# Altium schematic sheet Shutdown Circuit.SchDoc
size 279 x 187 mm; Origin: Eagle
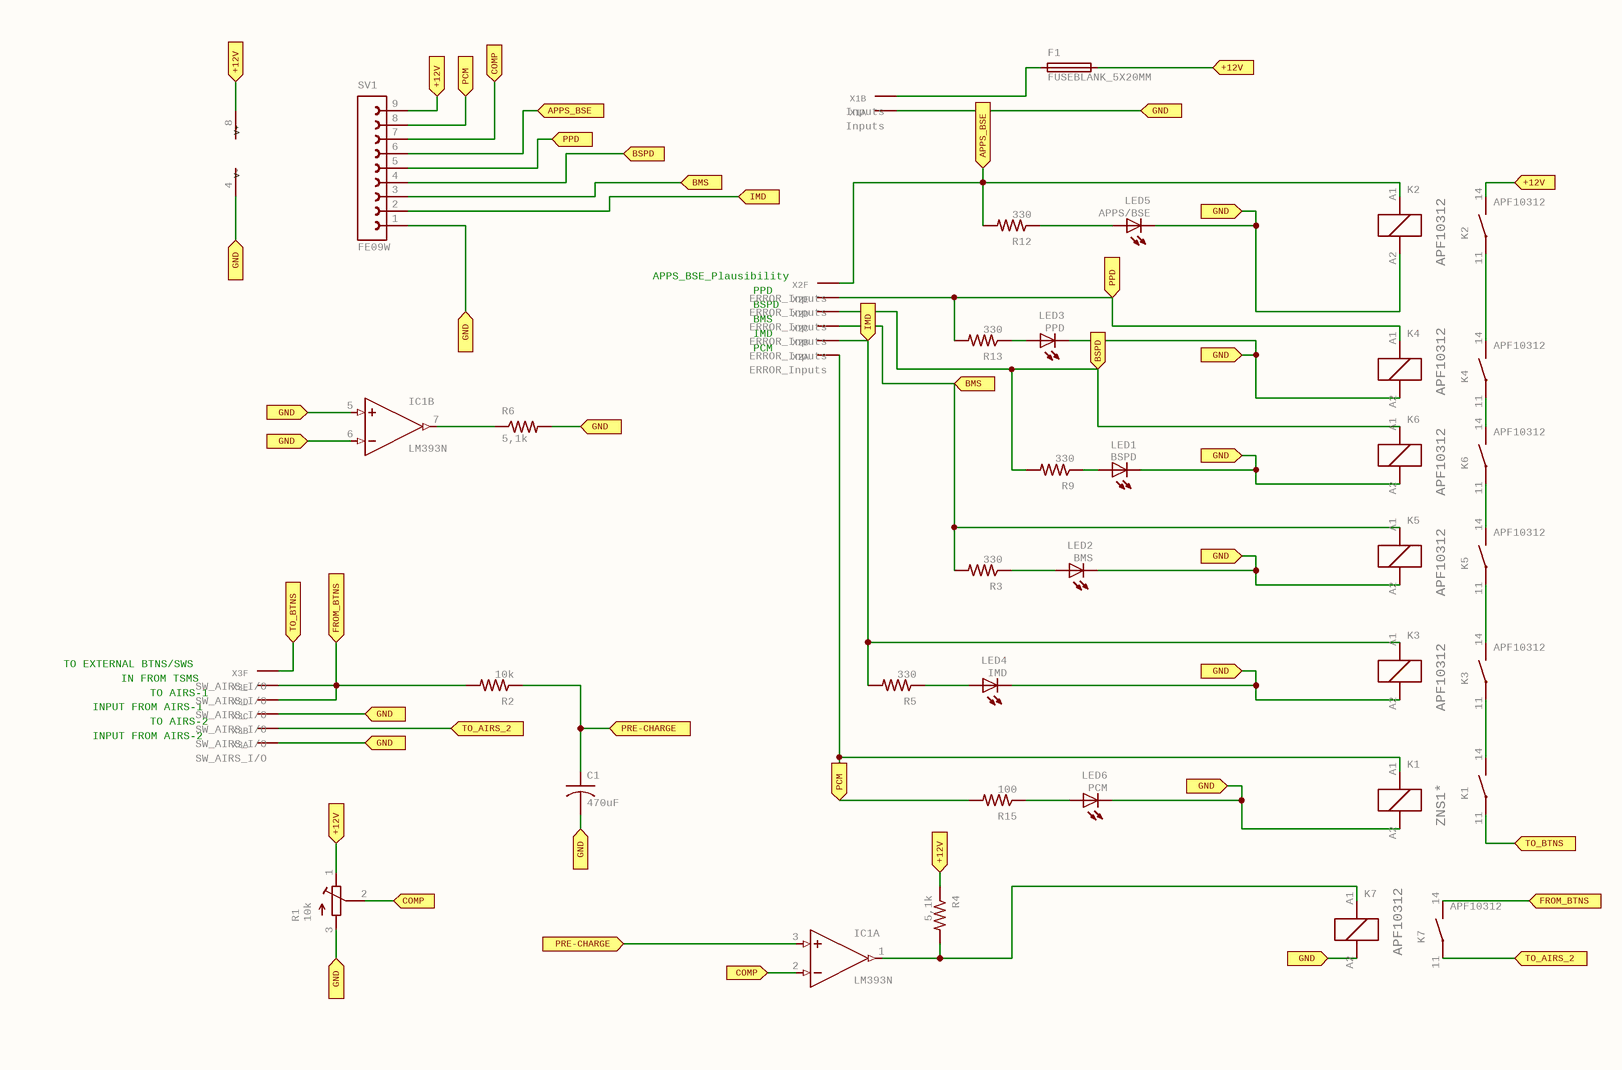
[diagram p0: Shutdown Circuit.SchDoc]

## Parts
APPS/BSE  LED5  [LED3MM]
BMS  LED2  [LED3MM]
BSPD  LED1  [LED3MM]
C1  470uF  [C050-045X075]
F1  FUSEBLANK_5X20MM  [FUSE_HOLDER_5X20MM]
IC1  LM393N  [DIL08]  (parts A,B,C of 3)
IMD  LED4  [LED3MM]
K1  ZNS1*  PART: K1  [ZN1]  (parts A,B of 2)
K2  APF10312  PART: K2  [SNR-V1]  (parts A,B of 2)
K3  APF10312  PART: K3  [SNR-V1]  (parts A,B of 2)
K4  APF10312  PART: K4  [SNR-V1]  (parts A,B of 2)
K5  APF10312  PART: K5  [SNR-V1]  (parts A,B of 2)
K6  APF10312  PART: K6  [SNR-V1]  (parts A,B of 2)
K7  APF10312  PART: K7  [SNR-V1]  (parts A,B of 2)
PCM  LED6  [LED3MM]
PPD  LED3  [LED3MM]
R1  10k  [RTRIM43P]
R2  10k  [0207/10]
R3  330  [0207/10]
R4  5,1k  [0207/10]
R5  330  [0207/10]
R6  5,1k  [0207/10]
R9  330  [0207/10]
R12  330  [0207/10]
R13  330  [0207/10]
R15  100  [0207/10]
SV1  FE09W  [FE09W]
X1  Inputs  [22-23-2021]  (parts A,B of 2)
X2  ERROR_Inputs  [22-23-2061]  (parts A,B,C,D,E,F of 6)
X3  SW_AIRS_I/O  [22-23-2061]  (parts A,B,C,D,E,F of 6)

## Ports
+12V (in), APPS_BSE (in), BMS (in), BSPD (in), COMP (in), FROM_BTNS (in), GND (in), IMD (in), PCM (in), PPD (in), PRE-CHARGE (in), TO_AIRS_2 (in), TO_BTNS (in)

## Nets
+12V: F1.2 IC1.8(V+) K2.14(S) R1.1(E) R4.1 SV1.9 ; port +12V
APPS_BSE: K2.A1 R12.2 SV1.6 X2.6(S) ; port APPS_BSE
BMS: K5.A1 R3.2 SV1.3 X2.3(S) ; port BMS
BSPD: K6.A1 R9.2 SV1.4 X2.4(S) ; port BSPD
COMP: IC1.2(-IN) R1.2(S) SV1.7 ; port COMP
FROM_BTNS: K7.14(S) R2.2 X3.4(S) X3.5(S) ; port FROM_BTNS
GND: APPS/BSE.K(C) BMS.K(C) BSPD.K(C) C1.2 IC1.4(V-) IC1.5(+IN) IC1.6(-IN) IMD.K(C) K1.A2 K2.A2 K3.A2 K4.A2 K5.A2 K6.A2 K7.A2 PCM.K(C) PPD.K(C) R1.3(A) R6.2 SV1.1 X1.1(S) X3.1(S) X3.3(S) ; port GND
IMD: K3.A1 R5.2 SV1.2 X2.2(S) ; port IMD
PCM: K1.A1 R15.2 SV1.8 X2.1(S) ; port PCM
PPD: K4.A1 R13.2 SV1.5 X2.5(S) ; port PPD
PRE-CHARGE: C1.1 IC1.3(+IN) R2.1 ; port PRE-CHARGE
TO_AIRS_2: K7.11(P) X3.2(S) ; port TO_AIRS_2
TO_BTNS: K1.11(P) X3.6(S) ; port TO_BTNS
NetAPPS/BSE_A: APPS/BSE.A R12.1
NetBMS_A: BMS.A R3.1
NetBSPD_A: BSPD.A R9.1
NetF1_1: F1.1 X1.2(S)
NetIC1_1: IC1.1(OUT) K7.A1 R4.2
NetIC1_7: IC1.7(OUT) R6.1
NetIMD_A: IMD.A R5.1
NetK1_14: K1.14(S) K3.11(P)
NetK2_11: K2.11(P) K4.14(S)
NetK3_14: K3.14(S) K5.11(P)
NetK4_11: K4.11(P) K6.14(S)
NetK5_14: K5.14(S) K6.11(P)
NetPCM_A: PCM.A R15.1
NetPPD_A: PPD.A R13.1

## Notes on the sheet
- APPS_BSE_Plausibility
- (near X2) PPD
- (near X2) BSPD
- (near X2) IMD
- (near X2) BMS
- (near X2) PCM
- TO EXTERNAL BTNS/SWS
- INPUT FROM AIRS-1
- IN FROM TSMS
- TO AIRS-1
- TO AIRS-2
- INPUT FROM AIRS-2

## Library data of the parts
APPS/BSE BMS BSPD IMD PCM PPD = LED3MM: LED   OSRAM: - CHIPLED LG R971, LG N971, LY N971, LG Q971, LY Q971, LO R971, LY R971 LH N974, LH R974 LS Q976, LO Q976, LY Q976 LO Q996 - Hyper CHIPLED LW Q18S LB Q993, LB Q99A, LB R99A - SideLED LS A670, LO A670, LY A670, LG A670, LP A670 LB A673, LV A673, LT A673, LW A673 LH A674 LY A675 LS A676, LA A676, LO A676, LY A676, LW A676 LS A679, LY A679, LG A679 -  Hyper Micro SIDELEDÂ® LS Y876, LA Y876, LO Y876, LY Y876 LT Y87S - SmartLED LW L88C, LW L88S LB L89C, LB L89S, LG L890 LS L89K, LO L89K, LY L89K LS L896, LA L896, LO L896, LY L896 - TOPLED LS T670, LO T670, LY T670, LG T670, LP T670 LSG T670, LSP T670, LSY T670, LOP T670, LYG T670 LG T671, LOG T671, LSG T671 LB T673, LV T673, LT T673, LW T673 LH T674 LS T676, LA T676, LO T676, LY T676, LB T676, LH T676, LSB T676, LW T676 LB T67C, LV T67C, LT T67C, LS T67K, LO T67K, LY T67K, LW E67C LS E67B, LA E67B, LO E67B, LY E67B, LB E67C, LV E67C, LT E67C LW T67C LS T679, LY T679, LG T679 LS T770, LO T770, LY T770, LG T770, LP T770 LB T773, LV T773, LT T773, LW T773 LH T774 LS E675, LA E675, LY E675, LS T675 LS T776, LA T776, LO T776, LY T776, LB T776 LHGB T686 LT T68C, LB T68C - Hyper Mini TOPLEDÂ® LB M676 - Mini TOPLED SantanaÂ® LG M470 LS M47K, LO M47K, LY M47K    Source: http://www.osram.convergy.de   LUXEON: - LUMILEDÂ® LXK2-PW12-R00, LXK2-PW12-S00, LXK2-PW14-U00, LXK2-PW14-V00 LXK2-PM12-R00, LXK2-PM12-S00, LXK2-PM14-U00 LXK2-PE12-Q00, LXK2-PE12-R00, LXK2-PE12-S00, LXK2-PE14-T00, LXK2-PE14-U00 LXK2-PB12-K00, LXK2-PB12-L00, LXK2-PB12-M00, LXK2-PB14-N00, LXK2-PB14-P00, LXK2-PB14-Q00 LXK2-PR12-L00, LXK2-PR12-M00, LXK2-PR14-Q00, LXK2-PR14-R00 LXK2-PD12-Q00, LXK2-PD12-R00, LXK2-PD12-S00 LXK2-PH12-R00, LXK2-PH12-S00 LXK2-PL12-P00, LXK2-PL12-Q00, LXK2-PL12-R00    Source: www.luxeon.com   KINGBRIGHT:   KA-3528ASYC Source: www.kingbright.com; GateName_1: G$1; DeviceName: 3MM; SymbolName_1: LED; LibraryName: led; DeviceSetName: LED; MF: MF; MPN: MPN; OC_NEWARK: OC_NEWARK
C1 = C-US050-045X075: CAPACITOR, American symbol; GateName_1: G$1; SymbolName_1: C-US-1; DeviceSetName: C-US; DeviceName: 050-045X075; LibraryName: resistor; MF: MF; MPN: MPN; OC_NEWARK: OC_NEWARK
F1 = FUSEBLANK_5X20MM: Fuse; GateName_1: G$1; SymbolName_1: FUSE; DeviceName: BLANK_5X20MM; LibraryName: fuse; DeviceSetName: FUSE; MF: MF; MPN: MPN; OC_FARNELL: unknown; OC_NEWARK: unknown
IC1 = LM393N: COMPARATOR; GateName_1: A; SymbolName_1: OPAMP; GateName_2: B; GateName_3: P; SymbolName_3: PWR+-; DeviceName: N; DeviceSetName: LM393; SymbolName_2: OPAMP; LibraryName: linear; MF: MF; MPN: MPN; OC_NEWARK: OC_NEWARK
K1 = ZNS1*: Miniature Power PCB Relay SCHRACK   1pole 10 A Source: http://www.schrack.com/.. 5847.pdf; GateName_1: 1; SymbolName_1: K; GateName_2: 2; SymbolName_2: S; LibraryName: relay; DeviceSetName: ZNS1*; MF: MF; MPN: MPN; OC_FARNELL: unknown; OC_NEWARK: unknown
K2-K7 = SN*R1: Slim PCB Relay 1 pole 6 A SCHRACK   Source: http://www.schrack.com/.. 5815.pdf; GateName_1: 1; SymbolName_1: K; GateName_2: 2; SymbolName_2: S; DeviceName: R1; DeviceSetName: SN*; LibraryName: relay; MF: MF; MPN: MPN; OC_FARNELL: unknown; OC_NEWARK: unknown
R1 = R-TRIMM43P: Trimm resistor; GateName_1: G$1; SymbolName_1: R-TRIM; DeviceName: 43P; LibraryName: rcl; DeviceSetName: R-TRIMM; MF: MF; MPN: MPN; OC_NEWARK: OC_NEWARK; SPICEMODEL: X; SPICEPREFIXL: POT
R2-R6 R9 R12 R13 R15 = R-US_0207/10: RESISTOR, American symbol; GateName_1: G$1; SymbolName_1: R-US; DeviceSetName: R-US_; DeviceName: 0207/10; LibraryName: resistor; MF: MF; MPN: MPN; OC_NEWARK: OC_NEWARK
SV1 = FE09W: FEMALE HEADER; GateName_1: G$1; SymbolName_1: FE09-1; LibraryName: con-lsta; DeviceSetName: FE09W; MF: MF; MPN: MPN; OC_FARNELL: unknown; OC_NEWARK: unknown
X1 = 22-23-2021: .100" (2.54mm) Center Header - 2 Pin; GateName_1: -1; SymbolName_1: MV; GateName_2: -2; SymbolName_2: M; MF: MOLEX; LibraryName: con-molex; DeviceSetName: 22-23-2021; MPN: 22-23-2021; OC_FARNELL: 1462926; OC_NEWARK: 25C3832
X2 X3 = 22-23-2061: .100" (2.54mm) Center Header - 6 Pin; GateName_1: -1; SymbolName_1: MV; GateName_2: -2; SymbolName_2: M; GateName_3: -3; GateName_4: -4; GateName_5: -5; GateName_6: -6; MF: MOLEX; SymbolName_3: M; SymbolName_4: M; SymbolName_5: M; SymbolName_6: M; LibraryName: con-molex; DeviceSetName: 22-23-2061; MPN: 22-23-2061; OC_FARNELL: 1462922; OC_NEWARK: 27C1933